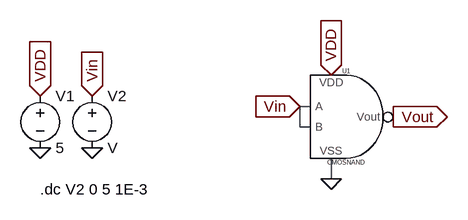
[diagram p0: schematic part_21_NAND.asc]
part_21_NAND.asc, the LTspice schematic file:
Version 4
SHEET 1 880 680
WIRE 96 144 80 144
WIRE 80 176 80 144
WIRE 96 176 80 176
WIRE 128 256 128 224
FLAG -320 128 VDD
IOPIN -320 128 In
FLAG -320 208 0
FLAG -240 208 0
FLAG -240 128 Vin
IOPIN -240 128 In
FLAG 80 144 Vin
IOPIN 80 144 In
FLAG 128 256 0
FLAG 128 96 VDD
IOPIN 128 96 In
FLAG 224 160 Vout
IOPIN 224 160 Out
SYMBOL voltage -320 112 R0
WINDOW 123 0 0 Left 0
WINDOW 39 0 0 Left 0
SYMATTR InstName V1
SYMATTR Value 5
SYMBOL voltage -240 112 R0
SYMATTR InstName V2
SYMBOL AutoGenerated\\CMOSNAND 144 160 R0
SYMATTR InstName U1
TEXT -320 272 Left 2 !.dc V2 0 5 1E-3

The netlist it stands for:
* part_21_NAND.asc
V1 VDD 0 5
V2 Vin 0 V
XU1 Vout Vin Vin VDD 0 CMOSNAND  ; pins Vout A B VDD VSS
.dc V2 0 5 1E-3
.lib .\CMOSNAND.lib
.backanno
.end

* Results of the author's LTspice run, read from the files saved beside the schematic
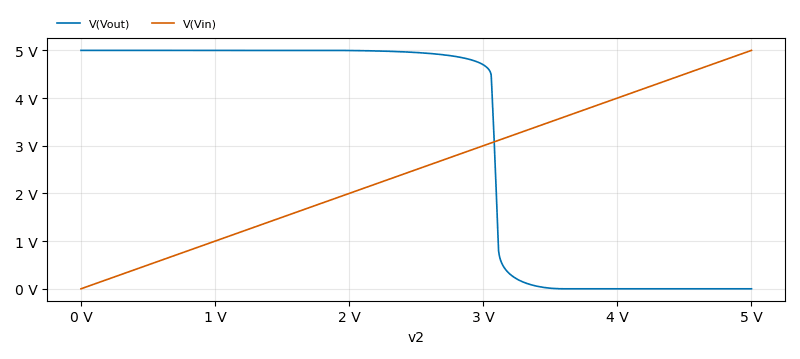
[diagram p1: DC transfer characteristic of part_21_NAND.asc, plotted from the saved traces]
* DC transfer characteristic, 1 run:
*   V(Vout): 5 V at v2=0 V, 14.28 nV at v2=5 V, min 14.28 nV, max 5 V
*   V(Vin): 0 V at v2=0 V, 5 V at v2=5 V, min 0 V, max 5 V